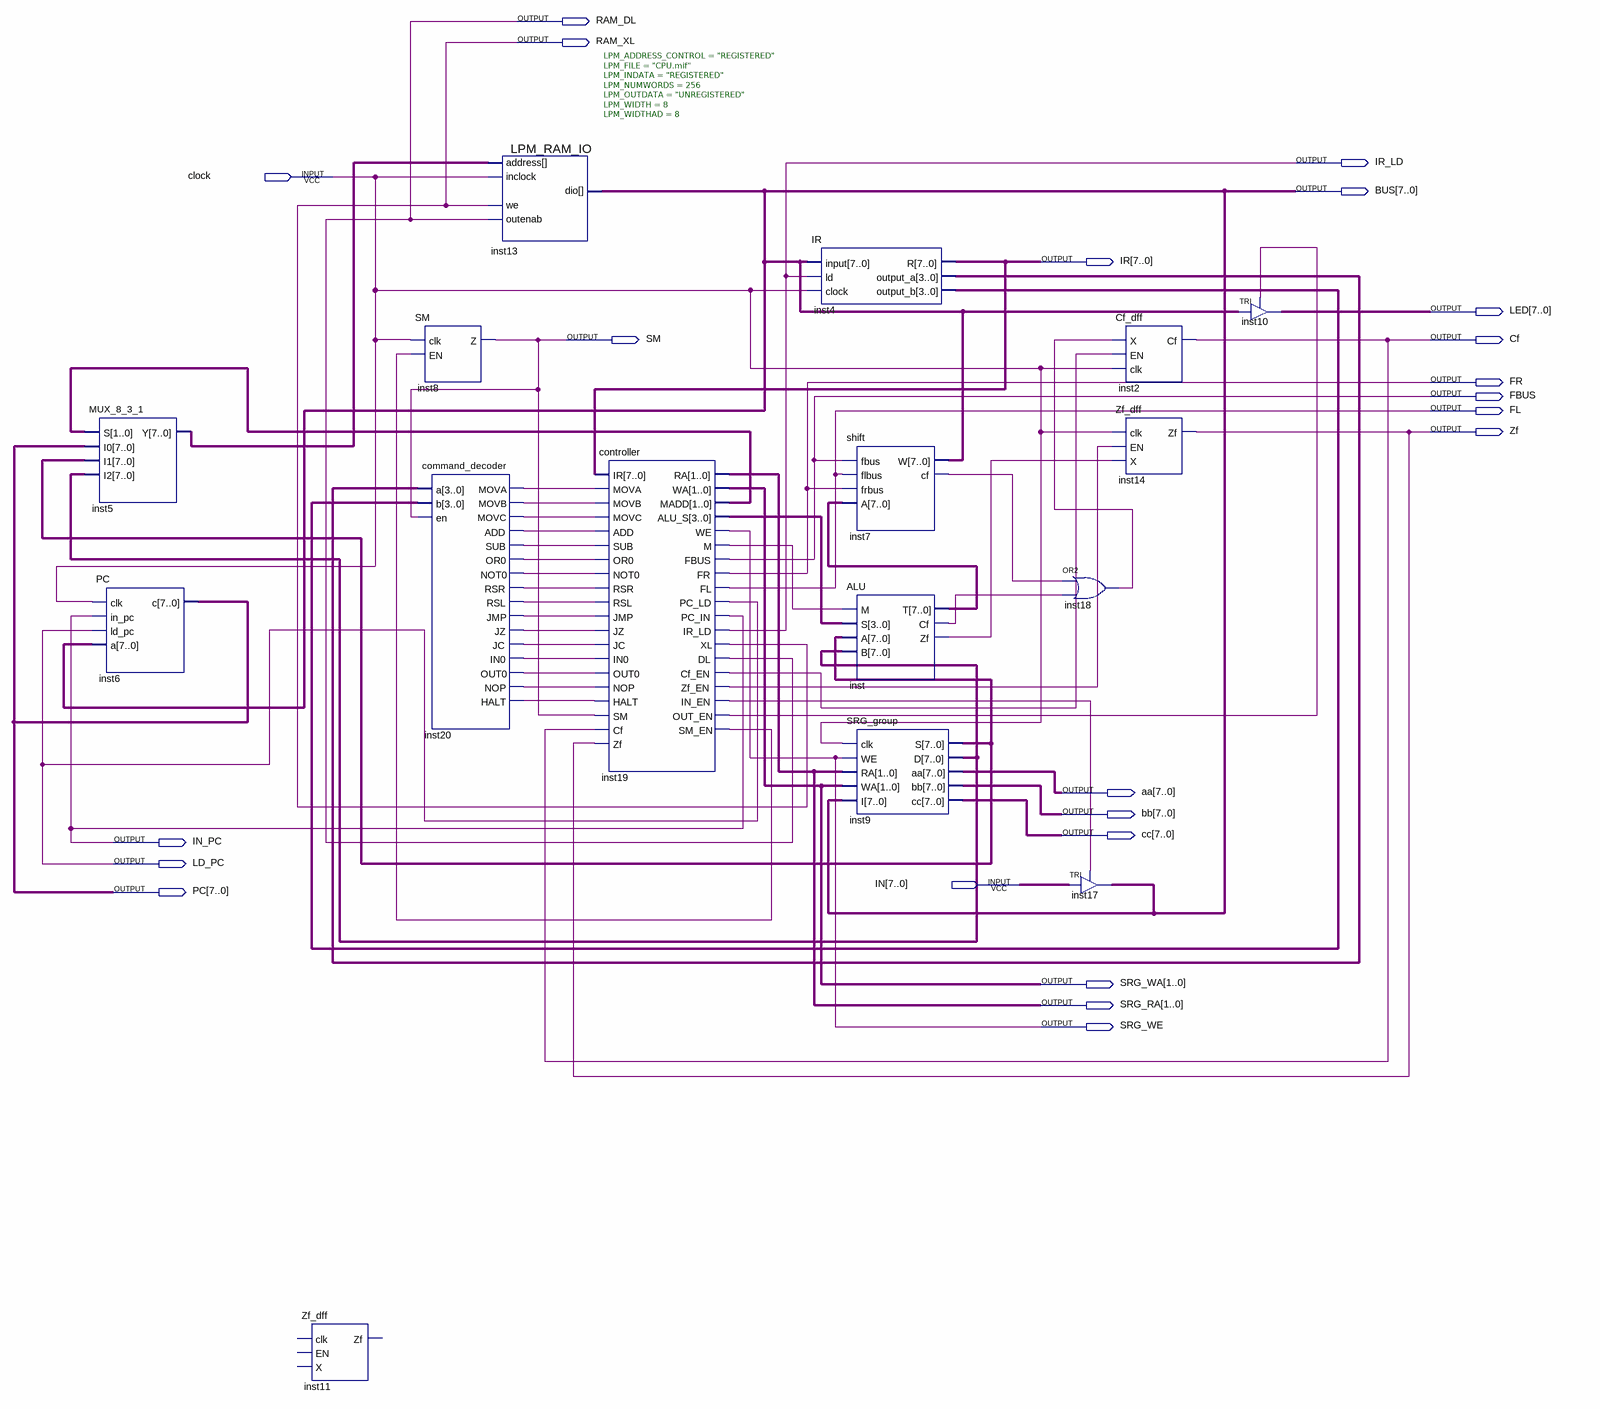
[diagram p0: schematic sheet]
// Quartus schematic CPU.bdf as structural Verilog: 16 symbols, 23 pins
module CPU (
  input  clock,
  input  [7:0] IN,
  output RAM_DL,
  output RAM_XL,
  output IR_LD,
  output [7:0] BUS,
  output [7:0] IR,
  output [7:0] LED,
  output SM,
  output Cf,
  output FR,
  output FBUS,
  output FL,
  output Zf,
  output [7:0] aa,
  output [7:0] bb,
  output [7:0] cc,
  output IN_PC,
  output LD_PC,
  output [7:0] PC,
  output [1:0] SRG_WA,
  output [1:0] SRG_RA,
  output SRG_WE
);

  wire inst7_cf, inst18_out, inst19_cf_en, inst19_in_en, inst19_m, inst19_out_en, inst19_sm_en, inst19_zf_en,
       inst20_add, inst20_halt, inst20_in0, inst20_jc, inst20_jmp, inst20_jz, inst20_mova, inst20_movb,
       inst20_movc, inst20_nop, inst20_not0, inst20_or0, inst20_out0, inst20_rsl, inst20_rsr, inst20_sub,
       inst_cf, inst_zf;
  wire [1:0] inst19_madd;
  wire [3:0] inst4_output_a, inst4_output_b, inst19_alu_s;
  wire [7:0] inst5_y, inst9_d, inst9_s, inst_t;

  MUX_8_3_1 inst5 (.S(inst19_madd), .I0(PC), .I1(inst9_s), .I2(inst9_d), .Y(inst5_y));
  PC inst6 (.clk(clock), .in_pc(IN_PC), .ld_pc(LD_PC), .a(BUS), .c(PC));
  Zf_dff inst11 ();  // open: clk, EN, X, Zf
  SM inst8 (.clk(clock), .EN(inst19_sm_en), .Z(SM));
  command_decoder inst20 (
    .a(inst4_output_a), .b(inst4_output_b), .en(SM), .MOVA(inst20_mova), .MOVB(inst20_movb),
    .MOVC(inst20_movc), .ADD(inst20_add), .SUB(inst20_sub), .OR0(inst20_or0), .NOT0(inst20_not0),
    .RSR(inst20_rsr), .RSL(inst20_rsl), .JMP(inst20_jmp), .JZ(inst20_jz), .JC(inst20_jc), .IN0(inst20_in0),
    .OUT0(inst20_out0), .NOP(inst20_nop), .HALT(inst20_halt));
  LPM_RAM_IO #(.LPM_ADDRESS_CONTROL("REGISTERED"), .LPM_FILE("CPU.mif"), .LPM_INDATA("REGISTERED"), .LPM_NUMWORDS(256), .LPM_OUTDATA("UNREGISTERED"), .LPM_WIDTH(8), .LPM_WIDTHAD(8)) inst13 (
    .address(inst5_y), .inclock(clock), .we(RAM_XL), .outenab(RAM_DL), .dio(BUS));
  controller inst19 (
    .IR(IR), .MOVA(inst20_mova), .MOVB(inst20_movb), .MOVC(inst20_movc), .ADD(inst20_add), .SUB(inst20_sub),
    .OR0(inst20_or0), .NOT0(inst20_not0), .RSR(inst20_rsr), .RSL(inst20_rsl), .JMP(inst20_jmp),
    .JZ(inst20_jz), .JC(inst20_jc), .IN0(inst20_in0), .OUT0(inst20_out0), .NOP(inst20_nop),
    .HALT(inst20_halt), .SM(SM), .Cf(Cf), .Zf(Zf), .RA(SRG_RA), .WA(SRG_WA), .MADD(inst19_madd),
    .ALU_S(inst19_alu_s), .WE(SRG_WE), .M(inst19_m), .FBUS(FBUS), .FR(FR), .FL(FL), .PC_LD(LD_PC),
    .PC_IN(IN_PC), .IR_LD(IR_LD), .XL(RAM_XL), .DL(RAM_DL), .Cf_EN(inst19_cf_en), .Zf_EN(inst19_zf_en),
    .IN_EN(inst19_in_en), .OUT_EN(inst19_out_en), .SM_EN(inst19_sm_en));
  IR inst4 (.\input (BUS), .ld(IR_LD), .clock(clock), .R(IR), .output_a(inst4_output_a), .output_b(inst4_output_b));
  shift inst7 (.fbus(FBUS), .flbus(FL), .frbus(FR), .A(inst_t), .W(BUS), .cf(inst7_cf));
  ALU inst (.M(inst19_m), .S(inst19_alu_s), .A(inst9_s), .B(inst9_d), .T(inst_t), .Cf(inst_cf), .Zf(inst_zf));
  SRG_group inst9 (
    .clk(clock), .WE(SRG_WE), .RA(SRG_RA), .WA(SRG_WA), .I(BUS), .S(inst9_s), .D(inst9_d), .aa(aa), .bb(bb),
    .cc(cc));
  Cf_dff inst2 (.X(inst18_out), .EN(inst19_cf_en), .clk(clock), .Cf(Cf));
  Zf_dff inst14 (.clk(clock), .EN(inst19_zf_en), .X(inst_zf), .Zf(Zf));
  or inst18 (inst18_out, inst7_cf, inst_cf);
  TRI inst17[7:0] (.IN(IN), .OE(inst19_in_en), .OUT(BUS));
  TRI inst10[7:0] (.IN(BUS), .OE(inst19_out_en), .OUT(LED));
endmodule
